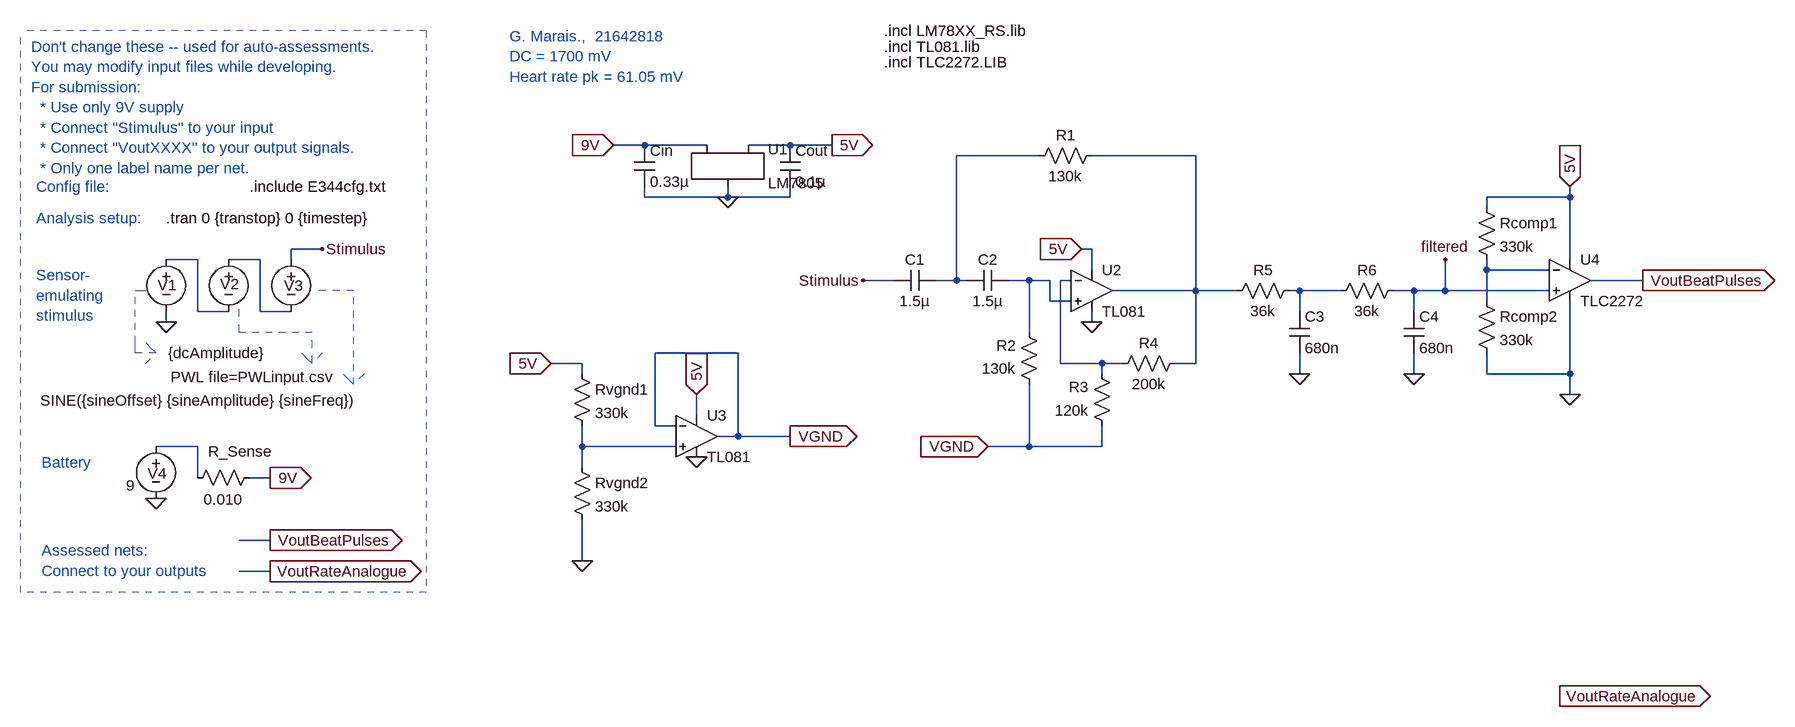
[diagram p0: schematic E344Ass2.asc]
E344Ass2.asc, the LTspice schematic file:
Version 4
SHEET 1 2080 680
WIRE -1344 -1232 -1392 -1232
WIRE -1248 -1232 -1344 -1232
WIRE -1120 -1232 -1184 -1232
WIRE -1056 -1232 -1120 -1232
WIRE -736 -1216 -864 -1216
WIRE -496 -1216 -656 -1216
WIRE -1344 -1152 -1344 -1168
WIRE -1216 -1152 -1216 -1168
WIRE -1216 -1152 -1344 -1152
WIRE -1120 -1152 -1120 -1168
WIRE -1120 -1152 -1216 -1152
WIRE 80 -1152 80 -1168
WIRE 80 -1152 -48 -1152
WIRE -48 -1136 -48 -1152
WIRE -1840 -1072 -1888 -1072
WIRE -656 -1072 -672 -1072
WIRE -2032 -1056 -2080 -1056
WIRE -1936 -1056 -1984 -1056
WIRE -1888 -1056 -1888 -1072
WIRE 80 -1056 80 -1152
WIRE -656 -1040 -656 -1072
WIRE -48 -1040 -48 -1056
WIRE 48 -1040 -48 -1040
WIRE -960 -1024 -1008 -1024
WIRE -864 -1024 -864 -1216
WIRE -864 -1024 -896 -1024
WIRE -848 -1024 -864 -1024
WIRE -752 -1024 -784 -1024
WIRE -720 -1024 -752 -1024
WIRE -688 -1024 -704 -1024
WIRE 192 -1024 112 -1024
WIRE -496 -1008 -496 -1216
WIRE -496 -1008 -624 -1008
WIRE -432 -1008 -496 -1008
WIRE -336 -1008 -352 -1008
WIRE -272 -1008 -336 -1008
WIRE -160 -1008 -192 -1008
WIRE -112 -1008 -112 -1056
WIRE -112 -1008 -160 -1008
WIRE 48 -1008 -112 -1008
WIRE -720 -992 -720 -1024
WIRE -688 -992 -720 -992
WIRE -48 -992 -48 -1040
WIRE -2032 -976 -2032 -1056
WIRE -1984 -976 -2032 -976
WIRE -1936 -976 -1936 -1056
WIRE -1888 -976 -1936 -976
WIRE -336 -976 -336 -1008
WIRE -160 -976 -160 -1008
WIRE -2080 -960 -2080 -976
WIRE -656 -960 -656 -976
WIRE -752 -944 -752 -1024
WIRE -1200 -912 -1328 -912
WIRE -1440 -896 -1488 -896
WIRE -704 -896 -704 -1024
WIRE -640 -896 -704 -896
WIRE -608 -896 -640 -896
WIRE -496 -896 -496 -1008
WIRE -496 -896 -528 -896
WIRE -1440 -880 -1440 -896
WIRE -640 -880 -640 -896
WIRE -336 -880 -336 -912
WIRE -160 -880 -160 -912
WIRE -48 -880 -48 -912
WIRE 80 -880 80 -992
WIRE 80 -880 -48 -880
WIRE 80 -848 80 -880
WIRE -1264 -816 -1264 -848
WIRE -1328 -800 -1328 -912
WIRE -1296 -800 -1328 -800
WIRE -1200 -784 -1200 -912
WIRE -1200 -784 -1232 -784
WIRE -1120 -784 -1200 -784
WIRE -2032 -768 -2096 -768
WIRE -1440 -768 -1440 -800
WIRE -1296 -768 -1440 -768
WIRE -752 -768 -752 -864
WIRE -752 -768 -816 -768
WIRE -640 -768 -640 -800
WIRE -640 -768 -752 -768
WIRE -1440 -736 -1440 -768
WIRE -2032 -720 -2032 -768
WIRE -1920 -720 -1952 -720
WIRE -1920 -624 -1968 -624
WIRE -1440 -592 -1440 -656
WIRE -1920 -576 -1968 -576
FLAG -2080 -960 0
FLAG -1840 -1072 Stimulus
FLAG -1920 -720 9V
IOPIN -1920 -720 Out
FLAG -2096 -688 0
FLAG -1392 -1232 9V
IOPIN -1392 -1232 In
FLAG -1920 -624 VoutBeatPulses
IOPIN -1920 -624 Out
FLAG -1920 -576 VoutRateAnalogue
IOPIN -1920 -576 Out
FLAG -1216 -1152 0
FLAG -1056 -1232 5V
IOPIN -1056 -1232 Out
FLAG -1120 -784 VGND
IOPIN -1120 -784 Out
FLAG -1440 -592 0
FLAG -1488 -896 5V
IOPIN -1488 -896 In
FLAG -656 -960 0
FLAG -672 -1072 5V
IOPIN -672 -1072 In
FLAG -816 -768 VGND
IOPIN -816 -768 In
FLAG -1264 -752 0
FLAG -1264 -848 5V
IOPIN -1264 -848 In
FLAG 80 -1168 5V
IOPIN 80 -1168 In
FLAG 80 -848 0
FLAG -160 -880 0
FLAG -336 -880 0
FLAG 192 -1024 VoutBeatPulses
IOPIN 192 -1024 Out
FLAG -1008 -1024 Stimulus
FLAG 64 -384 VoutRateAnalogue
IOPIN 64 -384 Out
FLAG -112 -1056 filtered
SYMBOL voltage -1984 -1072 R0
WINDOW 123 0 0 Left 0
WINDOW 39 0 0 Left 0
WINDOW 3 -89 197 Left 2
WINDOW 0 -13 54 Left 2
SYMATTR Value PWL file=PWLinput.csv
SYMATTR InstName V2
SYMBOL voltage -1888 -1072 R0
WINDOW 123 24 44 Left 2
WINDOW 39 0 0 Left 0
WINDOW 3 -386 233 Left 2
WINDOW 0 -11 56 Left 2
SYMATTR Value SINE({sineOffset} {sineAmplitude} {sineFreq})
SYMATTR InstName V3
SYMBOL voltage -2080 -1072 R0
WINDOW 123 0 0 Left 0
WINDOW 39 0 0 Left 0
WINDOW 3 3 160 Left 2
WINDOW 0 -13 55 Left 2
SYMATTR Value {dcAmplitude}
SYMATTR InstName V1
SYMBOL voltage -2096 -784 R0
WINDOW 123 24 44 Left 2
WINDOW 39 0 0 Left 0
WINDOW 3 -46 76 Left 2
WINDOW 0 -13 57 Left 2
SYMATTR Value 9
SYMATTR InstName V4
SYMBOL res -1936 -736 R90
WINDOW 0 -9 30 VBottom 2
WINDOW 3 34 56 VTop 2
SYMATTR InstName R_Sense
SYMATTR Value 0.010
SYMBOL LM7805 -1216 -1216 R0
SYMATTR InstName U1
SYMBOL cap -1360 -1232 R0
SYMATTR InstName Cin
SYMATTR Value 0.33µ
SYMBOL cap -1136 -1232 R0
SYMATTR InstName Cout
SYMATTR Value 0.1µ
SYMBOL res -1456 -896 R0
SYMATTR InstName Rvgnd1
SYMATTR Value 330k
SYMBOL res -1456 -752 R0
SYMATTR InstName Rvgnd2
SYMATTR Value 330k
SYMBOL cap -896 -1040 R90
WINDOW 0 0 32 VBottom 2
WINDOW 3 32 32 VTop 2
SYMATTR InstName C1
SYMATTR Value 1.5µ
SYMBOL cap -784 -1040 R90
WINDOW 0 0 32 VBottom 2
WINDOW 3 32 32 VTop 2
SYMATTR InstName C2
SYMATTR Value 1.5µ
SYMBOL res -640 -1232 R90
WINDOW 0 0 56 VBottom 2
WINDOW 3 32 56 VTop 2
SYMATTR InstName R1
SYMATTR Value 130k
SYMBOL res -736 -848 R180
WINDOW 0 36 76 Left 2
WINDOW 3 36 40 Left 2
SYMATTR InstName R2
SYMATTR Value 130k
SYMBOL res -624 -784 R180
WINDOW 0 36 76 Left 2
WINDOW 3 36 40 Left 2
SYMATTR InstName R3
SYMATTR Value 120k
SYMBOL res -512 -912 R90
WINDOW 0 0 56 VBottom 2
WINDOW 3 32 56 VTop 2
SYMATTR InstName R4
SYMATTR Value 200k
SYMBOL Opamps\\opamp2 -656 -1072 R0
SYMATTR InstName U2
SYMATTR Value TL081
SYMBOL Opamps\\opamp2 -1264 -848 R0
SYMATTR InstName U3
SYMATTR Value TL081
SYMBOL res -336 -1024 R90
WINDOW 0 0 56 VBottom 2
WINDOW 3 32 56 VTop 2
SYMATTR InstName R5
SYMATTR Value 36k
SYMBOL cap -352 -976 R0
SYMATTR InstName C3
SYMATTR Value 680n
SYMBOL Opamps\\opamp2 80 -1088 R0
SYMATTR InstName U4
SYMATTR Value TLC2272
SYMBOL cap -176 -976 R0
SYMATTR InstName C4
SYMATTR Value 680n
SYMBOL res -176 -1024 R90
WINDOW 0 0 56 VBottom 2
WINDOW 3 32 56 VTop 2
SYMATTR InstName R6
SYMATTR Value 36k
SYMBOL res -64 -1152 R0
SYMATTR InstName Rcomp1
SYMATTR Value 330k
SYMBOL res -64 -1008 R0
SYMATTR InstName Rcomp2
SYMATTR Value 330k
TEXT -2080 -1120 Left 2 !.tran 0 {transtop} 0 {timestep}
TEXT -1952 -1168 Left 2 !.include E344cfg.txt
TEXT -2288 -1384 Left 2 ;Don't change these -- used for auto-assessments.\nYou may modify input files while developing.\nFor submission: \n  * Use only 9V supply \n  * Connect "Stimulus" to your input\n  * Connect "VoutXXXX" to your output signals.\n  * Only one label name per net.
TEXT -2280 -1168 Left 2 ;Config file:
TEXT -2280 -1120 Left 2 ;Analysis setup:
TEXT -2272 -744 Left 2 ;Battery
TEXT -2280 -1032 Left 2 ;Sensor-\nemulating \nstimulus
TEXT -2272 -608 Left 2 ;Assessed nets:\nConnect to your outputs
TEXT -1552 -1400 Left 2 ;G. Marais.,  21642818\nDC = 1700 mV\nHeart rate pk = 61.05 mV
TEXT -976 -1408 Left 2 !.incl LM78XX_RS.lib
TEXT -976 -1384 Left 2 !.incl TL081.lib
TEXT -976 -1360 Left 2 !.incl TLC2272.LIB
LINE Normal -1792 -1008 -1856 -1008 2
LINE Normal -1792 -864 -1792 -1008 2
LINE Normal -1808 -880 -1792 -864 2
LINE Normal -1792 -864 -1808 -880 2
LINE Normal -1776 -880 -1792 -864 2
LINE Normal -2128 -1008 -2112 -1008 2
LINE Normal -2128 -928 -2128 -1008 2
LINE Normal -2128 -912 -2128 -928 2
LINE Normal -2096 -912 -2128 -912 2
LINE Normal -2112 -928 -2096 -912 2
LINE Normal -2096 -912 -2112 -928 2
LINE Normal -2112 -896 -2096 -912 2
LINE Normal -1968 -944 -1968 -992 2
LINE Normal -1856 -944 -1968 -944 2
LINE Normal -1856 -896 -1856 -944 2
LINE Normal -1872 -912 -1856 -896 2
LINE Normal -1856 -896 -1872 -912 2
LINE Normal -1840 -912 -1856 -896 2
LINE Normal -2304 -544 -2304 -1408 1
LINE Normal -1680 -1408 -1680 -544 1
LINE Normal -1680 -544 -2304 -544 1
LINE Normal -1680 -1408 -2304 -1408 1

The netlist it stands for:
* E344Ass2.asc
V2 N004 N003 PWL file=PWLinput.csv
V3 Stimulus N004 SINE({sineOffset} {sineAmplitude} {sineFreq})
V1 N003 0 {dcAmplitude}
V4 N009 0 9
R_Sense 9V N009 0.010
XU1 9V 0 5V LM7805
Cin 9V 0 0.33µ
Cout 5V 0 0.1µ
Rvgnd1 5V N010 330k
Rvgnd2 N010 0 330k
C1 N001 Stimulus 1.5µ
C2 N006 N001 1.5µ
R1 N002 N001 130k
R2 VGND N006 130k
R3 VGND N007 120k
R4 N002 N007 200k
XU2 N006 N007 5V 0 N002 TL081  ; pins In+ In- V+ V- OUT
XU3 N010 VGND 5V 0 VGND TL081  ; pins In+ In- V+ V- OUT
R5 N008 N002 36k
C3 N008 0 680n
XU4 filtered N005 5V 0 VoutBeatPulses TLC2272  ; pins In+ In- V+ V- OUT
C4 filtered 0 680n
R6 filtered N008 36k
Rcomp1 5V N005 330k
Rcomp2 N005 0 330k
.tran 0 {transtop} 0 {timestep}
.include E344cfg.txt
* Don't change these -- used for auto-assessments.
* You may modify input files while developing.
* For submission:
*   * Use only 9V supply
*   * Connect "Stimulus" to your input
*   * Connect "VoutXXXX" to your output signals.
*   * Only one label name per net.
* Config file:
* Analysis setup:
* Battery
* Sensor-
* emulating
* stimulus
* Assessed nets:
* Connect to your outputs
* G. Marais.,  21642818
* DC = 1700 mV
* Heart rate pk = 61.05 mV
.incl LM78XX_RS.lib
.incl TL081.lib
.incl TLC2272.LIB
.backanno
.end